# Altium schematic sheet PMTSafety.SchDoc
size A4
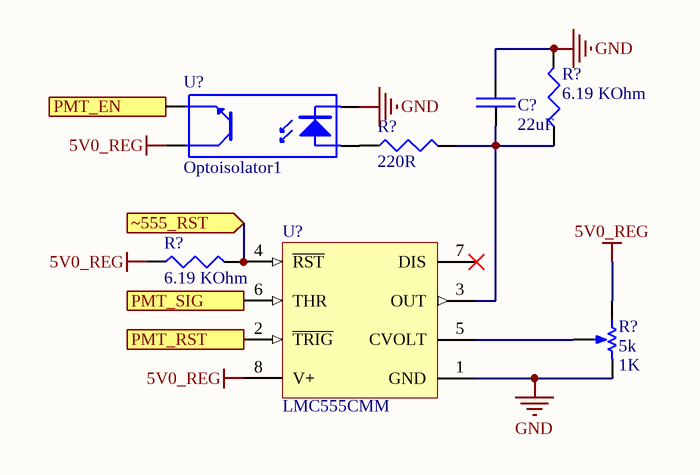
[diagram p0: PMTSafety.SchDoc]

## Parts
(Parts that share a designator on the sheet are numbered #1, #2 ... from top to bottom, then left to right.)
C?  22uF  [22uF Capacitor]
R?#1  6.19 KOhm  [6.19KOhm Resistor]
R?#2  220R
R?#3  6.19 KOhm  [6.19KOhm Resistor]
R?#4  5k  value 1K  [VR5]
U?#1  Optoisolator1  [DIP-4]
U?#2  LMC555CMM  [DGK0008A_N]

## Ports
PMT_EN (out), PMT_RST (in), PMT_SIG (in), ~555_RST (in)

## Nets
5V0_REG: R?#3.1 R?#4.1(TOP) U?#1.4(C) U?#2.8(V+)
GND: C?.1 R?#1.2 R?#4.2(BOT) U?#1.2(K) U?#2.1(GND)
PMT_EN: U?#1.3(E) ; port PMT_EN
PMT_RST: U?#2.2(~{TRIG}) ; port PMT_RST
PMT_SIG: U?#2.6(THR) ; port PMT_SIG
~555_RST: R?#3.2 U?#2.4(~{RST}) ; port ~555_RST
NetC?_2: C?.2 R?#1.1 R?#2.12 U?#2.3(OUT)
NetR?#2_11: R?#2.11 U?#1.1(A)
NetR?#4_3: R?#4.3(TAP) U?#2.5(CVOLT)

Not connected (* = marked no-connect by the designer): U?#2 7(DIS)*

## Library data of the parts
C? = GRM32ER71E226KE15L: Cap Ceramic 22uF 25V X7R 10% SMD 1210 125C Embossed T/R; Manufacturer 1: Murata; Supplier 1: Digi-Key; Supplier Part Number 1: 490-5313-6-ND; Manufacturer Part Number 1: GRM32ER71E226KE15L; Stock 1: 52660; Pricing 1: 1=1,78000, 10=1,40600, 100=1,05410, 500=0,79646 (USD); RoHS: Yes; Mount: Surface Mount; Case/Package: 1210; Number of Pins: 2; Case Code (Metric): 3225; Case Code (Imperial): 1210; Material: Ceramic; Min Operating Temperature: -55°C; Max Operating Temperature: 125°C; Capacitance: 22uF; Tolerance: 10%; Dielectric: X7R; Voltage Rating: 25V; Packaging: Tape and Reel; Package Quantity: 1; Voltage Rating (DC): 25V; Termination: SMD/SMT; Voltage: 25V; Length: 3.2mm; Height: 2.5mm; Width: 0.098inch; Thickness: 0.106inch; Depth: 2.5mm; Radiation Hardening: No; REACH SVHC: No SVHC; Lead Free: Lead Free; ComponentLink1URL: https://datasheet.ciiva.com/6072/1697714-6072768.pdf?src-supplier=Farnell; ComponentLink1Description: https://datasheet.ciiva.com/6072/1697714-6072768.pdf?src-supplier=Farnell; ComponentLink2URL: https://datasheet.ciiva.com/16497/product-16497009.pdf?src-supplier=Future+Electronics; ComponentLink2Description: https://datasheet.ciiva.com/16497/product-16497009.pdf?src-supplier=Future+Electronics; ComponentLink3URL: https://datasheet.ciiva.com/3776/2741grm32er71e226ke1523-3776996.pdf?src-supplier=Arrow; ComponentLink3Description: https://datasheet.ciiva.com/3776/2741grm32er71e226ke1523-3776996.pdf?src-supplier=Arrow; ComponentLink4URL: https://datasheet.ciiva.com/11789/0900766b80ef921d-11789129.pdf?src-supplier=RSComponents; ComponentLink4Description: https://datasheet.ciiva.com/11789/0900766b80ef921d-11789129.pdf?src-supplier=RSComponents; ComponentLink5URL: https://datasheet.ciiva.com/29201/451826-da-01-de-vs-kondens-grm32-er71e-226ke15l-29201795.pdf?src-supplier=Conrad; ComponentLink5Description: https://datasheet.ciiva.com/29201/451826-da-01-de-vs-kondens-grm32-er71e-226ke15l-29201795.pdf?src-supplier=Conrad; ComponentLink6URL: https://datasheet.ciiva.com/175/partnumbering-e-01-175746.pdf?src-supplier=Digi-Key; ComponentLink6Description: https://datasheet.ciiva.com/175/partnumbering-e-01-175746.pdf?src-supplier=Digi-Key; ComponentLink7URL: https://datasheet.ciiva.com/175/partnumbering-e-01-175747.pdf?src-supplier=Digi-Key; ComponentLink7Description: https://datasheet.ciiva.com/175/partnumbering-e-01-175747.pdf?src-supplier=Digi-Key; ComponentLink8URL: https://datasheet.ciiva.com/175/partnumbering-e-01-175748.pdf?src-supplier=Digi-Key; ComponentLink8Description: https://datasheet.ciiva.com/175/partnumbering-e-01-175748.pdf?src-supplier=Digi-Key; ComponentLink9URL: https://datasheet.ciiva.com/22703/1697714-22703397.pdf?src-supplier=Element14; ComponentLink9Description: https://datasheet.ciiva.com/22703/1697714-22703397.pdf?src-supplier=Element14; Category: Capacitor
R?#1 R?#3 = ERA3AEB6191V: RES SMD 6.19KOHM 0.1% 1/10W 0603; Manufacturer 1: Panasonic; Resistance: 6.19kR; Power Rating: 100mW; Voltage Rating: 75V; Temperature Coefficient: 25ppm/°C; Supplier 1: Digi-Key; Supplier Part Number 1: P6.19KDBCT-ND; Manufacturer Part Number 1: ERA3AEB6191V; Stock 1: 26110; Pricing 1: 1=0,35000, 10=0,30000, 100=0,11720, 1000=0,04906, 2500=0,04498 (USD); RoHS: Yes; Mount: Surface Mount; Case/Package: 0603; Number of Pins: 2; Case Code (Imperial): 0603; Case Code (Metric): 1608; Contact Plating: Tin; Min Operating Temperature: -55°C; Max Operating Temperature: 155°C; Tolerance: 0.1%; Packaging: Tape and Reel; Package Quantity: 1; Composition: Metal Film,Thin Film; Number of Terminations: 2; Military Standard: Not; Max Power Dissipation: 100mW; Voltage Rating (DC): 75V; Features: Automotive AEC-Q200; Length: 1.6mm; Height: 0.45mm; Width: 0.8mm; Depth: 0.8mm; Radiation Hardening: No; REACH SVHC: No SVHC; Lead Free: Lead Free; ComponentLink1URL: https://datasheet.ciiva.com/11809/0900766b80eb1d8c-11809038.pdf?src-supplier=RSComponents; ComponentLink1Description: https://datasheet.ciiva.com/11809/0900766b80eb1d8c-11809038.pdf?src-supplier=RSComponents; ComponentLink2URL: https://datasheet.ciiva.com/5971/485442-5971798.pdf?src-supplier=Farnell; ComponentLink2Description: https://datasheet.ciiva.com/5971/485442-5971798.pdf?src-supplier=Farnell; ComponentLink3URL: https://datasheet.ciiva.com/24026/aoa0000ce26-32660-24026983.pdf?src-supplier=Mouser; ComponentLink3Description: https://datasheet.ciiva.com/24026/aoa0000ce26-32660-24026983.pdf?src-supplier=Mouser; ComponentLink4URL: https://datasheet.ciiva.com/46447/485442-46447114.pdf?src-supplier=Element14; ComponentLink4Description: https://datasheet.ciiva.com/46447/485442-46447114.pdf?src-supplier=Element14; ComponentLink5URL: https://datasheet.ciiva.com/43457/485442-43457243.pdf?src-supplier=Farnell; ComponentLink5Description: https://datasheet.ciiva.com/43457/485442-43457243.pdf?src-supplier=Farnell; ComponentLink6URL: https://datasheet.ciiva.com/46447/485442-46447115.pdf?src-supplier=Element14; ComponentLink6Description: https://datasheet.ciiva.com/46447/485442-46447115.pdf?src-supplier=Element14; ComponentLink7URL: https://datasheet.ciiva.com/41450/001180853-da-01-en-widerstand-era-0603-6k19-0-1-5000st-41450170.pdf?src-supplier=Conrad; ComponentLink7Description: https://datasheet.ciiva.com/41450/001180853-da-01-en-widerstand-era-0603-6k19-0-1-5000st-41450170.pdf?src-supplier=Conrad
R?#2 = RT0603DRD07220RL: RES SMD 220 OHM 0.5% 1/10W 0603; Manufacturer 1: Yageo; Max Power Dissipation: 100mW; Temperature Coefficient: 25ppm/°C; Voltage Rating (DC): 50V; Supplier 1: Digi-Key; Supplier Part Number 1: 311-220DCT-ND; Manufacturer Part Number 1: RT0603DRD07220RL; Stock 1: 5545; Pricing 1: 1=0,20000, 10=0,16800, 100=0,06570, 1000=0,02750, 2500=0,02521 (USD); RoHS: Yes; Case/Package: 0603; Case Code (Metric): 1608; Case Code (Imperial): 0603; Min Operating Temperature: -55°C; Max Operating Temperature: 155°C; Package Quantity: 5000; Resistance: 220R; Tolerance: 0.5%; Packaging: Tape and Reel; Composition: Thin Film; Number of Terminations: 2; Features: Moisture Resistant; Length: 0.063inch; Height: 0.022inch; Width: 0.031inch; Lead Free: Lead Free; ComponentLink1URL: http://www.yageo.com/documents/recent/PYu-RT_1-to-0.01_RoHS_L_9.pdf?src-supplier=Digi-Key; ComponentLink1Description: http://www.yageo.com/documents/recent/PYu-RT_1-to-0.01_RoHS_L_9.pdf?src-supplier=Digi-Key; ComponentLink2URL: http://www.yageo.com/documents/recent/PYu-RT_1-to-0.01_RoHS_L_8.pdf?src-supplier=Digi-Key; ComponentLink2Description: http://www.yageo.com/documents/recent/PYu-RT_1-to-0.01_RoHS_L_8.pdf?src-supplier=Digi-Key; Category: Resistors
R?#4 = RPot: Potentiometer; Sim Note: Enter the Resistance value and the set point into parameter fields.; Set Position: 0.5; Published: 8-Jun-2000; LatestRevisionDate: 17-Jul-2002; LatestRevisionNote: Re-released for DXP Platform.; PackageReference: VR5; Publisher: Altium Limited; PackageDescription: Variable Resistor, Thru-Hole; 3 Leads
U?#1 = Optoisolator1: 4-Pin Phototransistor Optocoupler; Published: 24-Mar-1999; LatestRevisionDate: 04-Mar-2005; LatestRevisionNote: Sch pins 3 & 4 Swapped.; DatasheetVersion: Nov-2003; PackageReference: DIP-4; Publisher: Altium Limited
U?#2 = CMP-0056-00151-3: CMOS Timer, 8-pin Mini SOIC; Manufacturer: Texas Instruments; CompType: Analog IC; PowerWise: N; PackageTopMarking: ZXTT*ZC5; ComponentLink1URL: http://www.ti.com/general/docs/lit/getliterature.tsp?genericPartNumber=LMC555&fileType=pdf; Code_JEDEC: MO-187-AA; PackageDescription: MINI SOIC, .118 x .118 x .034in, 8 Lead, .0256in Pitch; PackageReference: DGK0008A; PinCount: 8; ComponentLink1Description: Datasheet URL; RoHS: N